# Altium schematic sheet Power.SchDoc
size C; SheetNumber: 1; SheetTotal: 1; SPICEModelCacheRKNZGAWU: <root> / <DocumentId>RKNZGAWU</DocumentId> / </root>
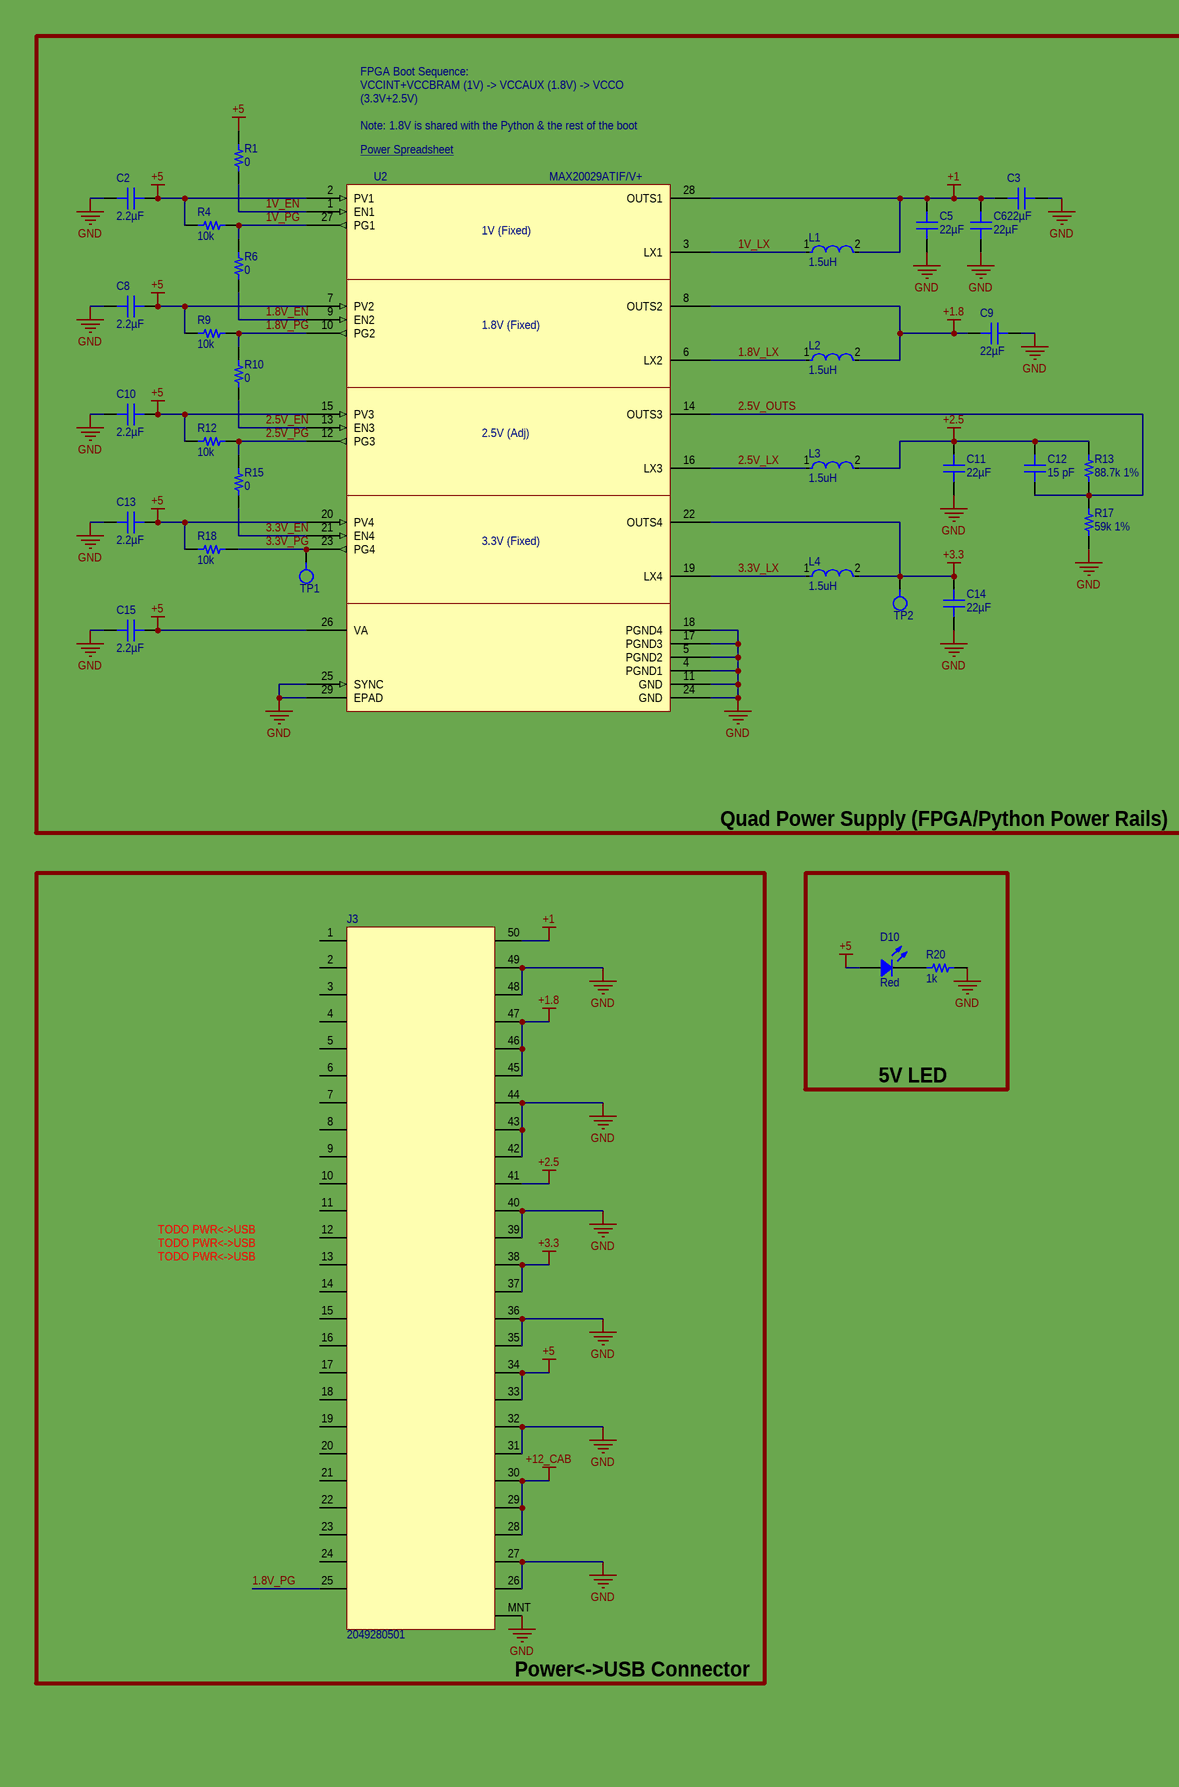
[diagram p0: Power.SchDoc, left]
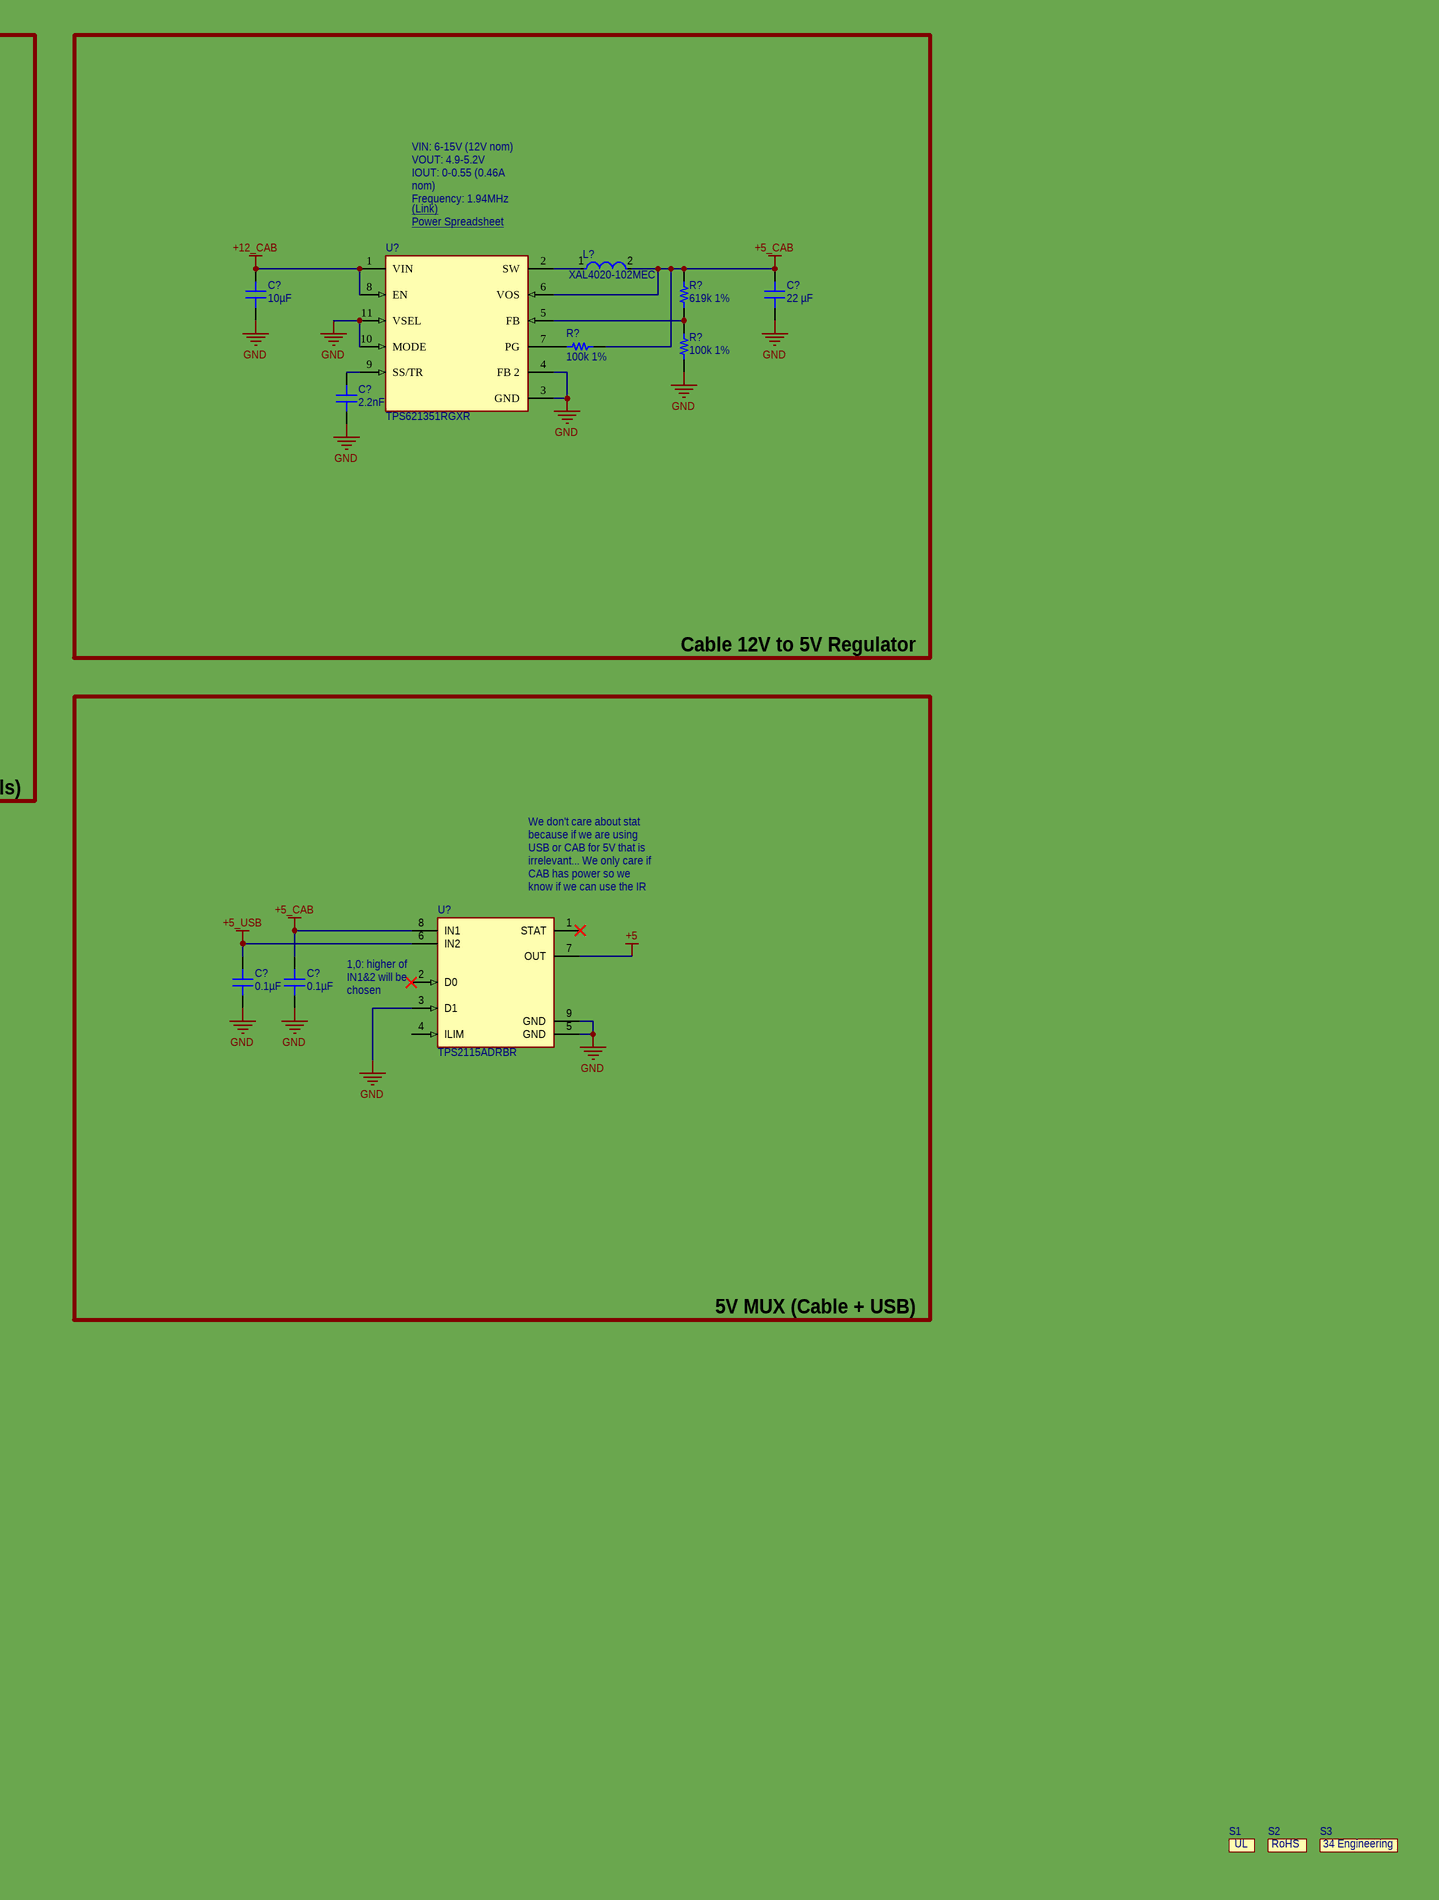
[diagram p1: Power.SchDoc, right]

## Parts
(Parts that share a designator on the sheet are numbered #1, #2 ... from top to bottom, then left to right.)
C2  2.2µF  [CAP 0603_1608]
C3  22µF  [CAP 0603_1608]
C5  22µF  [CAP 0603_1608]
C6  22µF  [CAP 0603_1608]
C8  2.2µF  [CAP 0603_1608]
C9  22µF  [CAP 0603_1608]
C10  2.2µF  [CAP 0603_1608]
C11  22µF  [CAP 0603_1608]
C12  15 pF  [CAP 0402_1005]
C13  2.2µF  [CAP 0603_1608]
C14  22µF  [CAP 0603_1608]
C15  2.2µF  [CAP 0603_1608]
C?#1  10µF  [CAP 0805_2012]
C?#2  22 µF  [CAP 0805_2012]
C?#3  2.2nF  [CAP 0402_1005]
C?#4  0.1µF  [CAP 0402_1005]
C?#5  0.1µF  [CAP 0402_1005]
D10  Red  [LED 0603_1608 RED]
J3  2049280501  [2049280501]
L1  1.5uH  [FP-DFE252012C-IPC_C]
L2  1.5uH  [FP-DFE252012C-IPC_C]
L3  1.5uH  [FP-DFE252012C-IPC_C]
L4  1.5uH  [FP-DFE252012C-IPC_C]
L?  XAL4020-102MEC  [FP-XAL4020-102MEC-MFG]
R1  0  [RES 0402_1005]
R4  10k  [RES 0402_1005]
R6  0  [RES 0402_1005]
R9  10k  [RES 0402_1005]
R10  0  [RES 0402_1005]
R12  10k  [RES 0402_1005]
R13  88.7k 1%  [RES 0402_1005]
R15  0  [RES 0402_1005]
R17  59k 1%  [RES 0402_1005]
R18  10k  [RES 0402_1005]
R20  1k  [RES 0402_1005]
R?#1  619k 1%  [RES 0402_1005]
R?#2  100k 1%  [RES 0402_1005]
R?#3  100k 1%  [RES 0402_1005]
S1  (no value)  [UL]
S2  (no value)  [RoHS]
S3  (no value)  [34EngineeringLogo]
TP1  (no value)  [TestPoint1mm]
TP2  (no value)  [TestPoint1mm]
U2  MAX20029ATIF/V+  [MAX20029ATIF/V+]
U?#1  TPS621351RGXR  [FP-RGX0011A-MFG]
U?#2  TPS2115ADRBR  [FP-DRB0008B-IPC_B]

## Blocks framed on the sheet
Quad Power Supply (FPGA/Python Power Rails): C2 C3 C5 C6 C8-C15 L1-L4 R1 R4 R6 R9 R10 R12 R13 R15 R17 R18 TP1 TP2 U2
Cable 12V to 5V Regulator: C?#1-C?#3 L? R?#1-R?#3 U?#1
5V MUX (Cable + USB): C?#4 C?#5 U?#2
Power<->USB Connector: J3
5V LED: D10 R20

## Nets
+1: C3.2 C5.2 C6.2 J3.50 L1.2 U2.28(OUTS1)
+1.8: C9.2 J3.45 J3.46 J3.47 L2.2 U2.8(OUTS2)
+2.5: C11.2 C12.2 J3.41 L3.2 R13.2
+3.3: C14.2 J3.37 J3.38 L4.2 TP2.1 U2.22(OUTS4)
+5: C2.2 C8.2 C10.2 C13.2 C15.2 D10.1 J3.33 J3.34 R1.2 R4.2 R9.2 R12.2 R18.2 U2.2(PV1) U2.7(PV2) U2.15(PV3) U2.20(PV4) U2.26(VA) U?#2.7(OUT)
+5_CAB: C?#2.2 C?#5.2 L?.2 R?#1.2 R?#2.1 U?#1.6(VOS) U?#2.8(IN1)
+5_USB: C?#4.2 U?#2.6(IN2)
+12_CAB: C?#1.2 J3.28 J3.29 J3.30 U?#1.1(VIN) U?#1.8(EN)
GND: C2.1 C3.1 C5.1 C6.1 C8.1 C9.1 C10.1 C11.1 C13.1 C14.1 C15.1 C?#1.1 C?#2.1 C?#3.1 C?#4.1 C?#5.1 J3.26 J3.27 J3.31 J3.32 J3.35 J3.36 J3.39 J3.40 J3.42 J3.43 J3.44 J3.48 J3.49 J3.MNT R17.1 R20.2 R?#3.1 U2.4(PGND1) U2.5(PGND2) U2.11(GND) U2.17(PGND3) U2.18(PGND4) U2.24(GND) U2.25(SYNC) U2.29(EPAD) U?#1.3(GND) U?#1.4(FB_2) U?#1.10(MODE) U?#1.11(VSEL) U?#2.3(D1) U?#2.5(GND) U?#2.9(GND)
1.8V_EN: R6.1 U2.9(EN2)
1.8V_LX: L2.1 U2.6(LX2)
1.8V_PG: J3.25 R9.1 R10.2 U2.10(PG2)
1V_EN: R1.1 U2.1(EN1)
1V_LX: L1.1 U2.3(LX1)
1V_PG: R4.1 R6.2 U2.27(PG1)
2.5V_EN: R10.1 U2.13(EN3)
2.5V_LX: L3.1 U2.16(LX3)
2.5V_OUTS: C12.1 R13.1 R17.2 U2.14(OUTS3)
2.5V_PG: R12.1 R15.2 U2.12(PG3)
3.3V_EN: R15.1 U2.21(EN4)
3.3V_LX: L4.1 U2.19(LX4)
3.3V_PG: R18.1 TP1.1 U2.23(PG4)
NetC?#3_2: C?#3.2 U?#1.9(SS/TR)
NetD10_2: D10.2 R20.1
NetL?_1: L?.1 U?#1.2(SW)
NetR?#1_1: R?#1.1 R?#3.2 U?#1.5(FB)
NetR?#2_2: R?#2.2 U?#1.7(PG)

Not connected (* = marked no-connect by the designer): J3 1 2 3 4 5 6 7 8 9 10 11 12 13 14 15 16 17 18 19 20 21 22 23 24; U?#2 1(STAT)* 2(D0)* 4(ILIM)

## Notes on the sheet
- FPGA Boot Sequence:
  VCCINT+VCCBRAM (1V) -> VCCAUX (1.8V) -> VCCO (3.3V+2.5V)
  Note: 1.8V is shared with the Python & the rest of the boot sequence is on PCB B
- (near U2) Power Spreadsheet <https://docs.google.com/spreadsheets/d/1ZgsUlgWdU-n38x_ZLdApPnWk-g0t3dJyEVXrgmfgov0/edit#gid=0>
- (near U2) 1V (Fixed)
- (Link) <https://webench.ti.com/power-designer/switching-regulator/customize/42?noparams=0>
- VIN: 6-15V (12V nom)
  VOUT: 4.9-5.2V
  IOUT: 0-0.55 (0.46A nom)
  Frequency: 1.94MHz
  Efficiency: 90.3% nom
- (near U?#1) Power Spreadsheet <https://docs.google.com/spreadsheets/d/1ZgsUlgWdU-n38x_ZLdApPnWk-g0t3dJyEVXrgmfgov0/edit#gid=0>
- (near U2) 1.8V (Fixed)
- (near U2) 2.5V (Adj)
- (near U2) 3.3V (Fixed)
- (near U?#2) We don't care about stat because if we are using USB or CAB for 5V that is irrelevant... We only care if CAB has power so we know if we can use the IR LEDs
- (near U?#2) 1,0: higher of IN1&2 will be chosen
- TODO PWR<->USB
- (in symbol 34EngineeringLogo) 34 Engineering

## Library data of the parts
C2 C8 C10 C13 C15 = 0603ZD225MAT2A: CAP CER 2.2UF 10V X5R 0603; manufacturer: AVX Corporation; Tolerance: ±20%; Part Number: 0603ZD225MAT2A; Value: 2.2µF; Applications: General Purpose; Capacitance: 2.2µF; componentlink1description: Datasheet; componentlink1url: http://datasheets.avx.com/cx5r.pdf; componentlink2description: DigiKey Link; componentlink2url: http://digikey.com/product-detail/en/avx-corporation/0603ZD225MAT2A/478-7941-1-ND/3881564; Device Package: 0603 (1608 Metric); lastupdated: 9/2/2020 1:03:07 AM; Lifecycle Status: Active; Minimum Order: 1; Mounting Type: Surface Mount, MLCC; Operating Temperature: -55°C ~ 85°C; Package / Case: 0603 (1608 Metric); packaging: TapeAndReel; partid: 16270; Part Status: Active; price: 0.04; series: -; Size / Dimension: 0.063" L x 0.032" W (1.60mm x 0.81mm); Supplier 1: DigiKey; Supplier Part Number 1: 478-7941-1-ND; Temperature Coefficient: X5R; Thickness (Max): 0.035" (0.90mm); Voltage - Rated: 10V
C3 C5 C6 C9 C11 C14 = 06036D226MAT2A: CAP CER 22UF 6.3V X5R 0603; manufacturer: AVX Corporation; Tolerance: ±20%; Part Number: 06036D226MAT2A; Value: 22µF; Applications: General Purpose; Capacitance: 22µF; componentlink1description: Datasheet; componentlink1url: http://datasheets.avx.com/cx5r.pdf; componentlink2description: DigiKey Link; componentlink2url: http://digikey.com/product-detail/en/avx-corporation/06036D226MAT2A/478-10812-1-ND/7536349; Device Package: 0603 (1608 Metric); lastupdated: 9/2/2020 1:03:16 AM; Lifecycle Status: Active; Minimum Order: 1; Mounting Type: Surface Mount, MLCC; Operating Temperature: -55°C ~ 85°C; Package / Case: 0603 (1608 Metric); packaging: TapeAndReel; partid: 13180; Part Status: Active; price: 0.10; series: -; Size / Dimension: 0.063" L x 0.032" W (1.60mm x 0.81mm); Supplier 1: DigiKey; Supplier Part Number 1: 478-10812-1-ND; Temperature Coefficient: X5R; Thickness (Max): 0.040" (1.02mm); Voltage - Rated: 6.3V
C12 = 885012005008: CAP CER 15PF 10V C0G/NP0 0402; manufacturer: Würth Elektronik; Temperature Coefficient: C0G, NP0; Tolerance: ±5%; Part Number: 885012005008; Value: 15 pF; Applications: General Purpose; Capacitance: 15 pF; componentlink1description: Datasheet; componentlink1url: https://katalog.we-online.de/pbs/datasheet/885012005008.pdf; componentlink2description: DigiKey Link; componentlink2url: https://www.digikey.com/en/products/detail/würth-elektronik/885012005008/5453281; Device Package: 0402 (1005 Metric); lastupdated: 7/10/2022 8:59:25 AM; Lifecycle Status: Active; Minimum Order: 1; Mounting Type: Surface Mount, MLCC; Operating Temperature: -55°C ~ 125°C; Package / Case: 0402 (1005 Metric); packaging: TapeAndReel; partid: 7101; Part Status: Active; price: 0.01; series: WCAP-CSGP; Size / Dimension: 0.039" L x 0.020" W (1.00mm x 0.50mm); Supplier 1: DigiKey; Supplier Part Number 1: 732-7426-1-ND; Thickness (Max): 0.022" (0.55mm); Voltage - Rated: 10V
C?#1 = 08053D106KAT2A: CAP CER 10UF 25V X5R 0805; manufacturer: AVX Corporation; Tolerance: ±10%; Part Number: 08053D106KAT2A; Value: 10µF; Applications: General Purpose; Capacitance: 10µF; componentlink1description: Datasheet; componentlink1url: http://datasheets.avx.com/cx5r.pdf; componentlink2description: DigiKey Link; componentlink2url: http://digikey.com/product-detail/en/avx-corporation/08053D106KAT2A/478-7436-1-ND/3660337; Device Package: 0805 (2012 Metric); lastupdated: 9/2/2020 1:04:14 AM; Lifecycle Status: Active; Minimum Order: 1; Mounting Type: Surface Mount, MLCC; Operating Temperature: -55°C ~ 85°C; Package / Case: 0805 (2012 Metric); packaging: TapeAndReel; partid: 15850; Part Status: Active; price: 0.13; series: -; Size / Dimension: 0.079" L x 0.049" W (2.00mm x 1.25mm); Supplier 1: DigiKey; Supplier Part Number 1: 478-7436-1-ND; Temperature Coefficient: X5R; Thickness (Max): 0.051" (1.30mm); Voltage - Rated: 25V
C?#2 = TMK212BBJ226MG-TT: CAP CER 22UF 25V X5R 0805; manufacturer: Taiyo Yuden; Tolerance: ±20%; Part Number: TMK212BBJ226MG-TT; Value: 22 µF; Applications: SMPS Filtering; Capacitance: 22 µF; componentlink1description: Datasheet; componentlink1url: https://ds.yuden.co.jp/TYCOMPAS/ut/detail?pn=TMK212BBJ226MG-TT &u=M; componentlink2description: DigiKey Link; componentlink2url: https://www.digikey.com/en/products/detail/taiyo-yuden/TMK212BBJ226MG-TT/7403956; Device Package: 0805 (2012 Metric); lastupdated: 7/10/2022 9:05:54 AM; Lifecycle Status: Active; Minimum Order: 1; Mounting Type: Surface Mount, MLCC; Operating Temperature: -55°C ~ 85°C; Package / Case: 0805 (2012 Metric); packaging: TapeAndReel; partid: 8285; Part Status: Active; price: 0.21; series: M; Size / Dimension: 0.079" L x 0.049" W (2.00mm x 1.25mm); Supplier 1: DigiKey; Supplier Part Number 1: 587-6359-1-ND; Temperature Coefficient: X5R; Thickness (Max): 0.057" (1.45mm); Voltage - Rated: 25V
C?#3 = C0402C222K3RAC7867: CAP CER 2200PF 25V X7R 0402; manufacturer: KEMET; Tolerance: ±10%; Part Number: C0402C222K3RAC7867; Applications: Bypass, Decoupling; Capacitance: 2200 pF; componentlink1description: Datasheet; componentlink1url: https://api.kemet.com/component-edge/download/datasheet/C0402C222K3RACTU.pdf; componentlink2description: DigiKey Link; componentlink2url: https://www.digikey.com/en/products/detail/kemet/C0402C222K3RAC7867/411035; Device Package: 0402 (1005 Metric); lastupdated: 8/14/2022 9:05:11 PM; Lifecycle Status: Active; Minimum Order: 1; Mounting Type: Surface Mount, MLCC; Operating Temperature: -55°C ~ 125°C; Package / Case: 0402 (1005 Metric); packaging: TapeAndReel; partid: 33073; Part Status: Active; price: 0.01; series: SMD Comm X7R; Size / Dimension: 0.039" L x 0.020" W (1.00mm x 0.50mm); Supplier 1: DigiKey; Supplier Part Number 1: 399-C0402C222K3RAC7867CT-ND; Temperature Coefficient: X7R; Thickness (Max): 0.022" (0.55mm); Voltage - Rated: 25V
C?#4 C?#5 = CGA2B3X5R1E104K050BB: CAP CER 0.1UF 25V X5R 0402; manufacturer: TDK Corporation; Tolerance: ±10%; Part Number: CGA2B3X5R1E104K050BB; Applications: Automotive; Capacitance: 0.1 µF; componentlink1description: Datasheet; componentlink1url: https://product.tdk.com/info/en/catalog/datasheets/mlcc_automotive_general_en.pdf?ref_disty=digikey; componentlink2description: DigiKey Link; componentlink2url: https://www.digikey.com/en/products/detail/tdk-corporation/CGA2B3X5R1E104K050BB/3949421; Device Package: 0402 (1005 Metric); lastupdated: 8/14/2022 9:05:24 PM; Lifecycle Status: Active; Minimum Order: 1; Mounting Type: Surface Mount, MLCC; Operating Temperature: -55°C ~ 85°C; Package / Case: 0402 (1005 Metric); packaging: TapeAndReel; partid: 45466; Part Status: Active; price: 0.01; Ratings: AEC-Q200; series: CGA; Size / Dimension: 0.039" L x 0.020" W (1.00mm x 0.50mm); Supplier 1: DigiKey; Supplier Part Number 1: 445-12185-1-ND; Temperature Coefficient: X5R; Thickness (Max): 0.022" (0.55mm); Voltage - Rated: 25V
D10 = SML-D12U1WT86: LED RED DIFFUSED 1608 SMD; Manufacturer: Rohm Semiconductor; Configuration: Standard; Current - Test: 20mA; Lens Color: White; Lens Size: 1.20mm x 0.80mm; Lens Style: Rectangle with Flat Top; Millicandela Rating: 63mcd; Voltage - Forward (Vf) (Typ): 2.2V; Wavelength - Dominant: 620nm; Part Number: SML-D12U1WT86; Color: Red; ComponentLink1Description: Datasheet; ComponentLink1URL: https://www.rohm.com/datasheet/SML-D12U1W; ComponentLink2Description: DigiKey Link; ComponentLink2URL: https://www.digikey.com/en/products/detail/rohm-semiconductor/SML-D12U1WT86/5843853; Device Package: 0603 (1608 Metric); Height (Max): 0.65mm; LastUpdated: 7/10/2022 9:48:39 AM; Lens Transparency: Diffused; Lifecycle Status: Active; Minimum Order: 1; Mounting Type: Surface Mount; Package / Case: 0603 (1608 Metric); Packaging: TapeAndReel; PartId: 452; Part Status: Active; Price: 0.02; Series: SML-D12; Size / Dimension: 1.60mm L x 0.80mm W; Supplier 1: DigiKey; Supplier Part Number 1: SML-D12U1WT86CT-ND; Supplier Device Package: 1608 (0603); Value: Red
J3 = 2049280501: SlimStack Board-to-Board Plug, 0.40mm Pitch, FSB3 Floating Series, 3.00mm Mated Height, 3.20 Mated Width, 50 Circuits; Manufacturer: Molex; Manufacturer Part Number: 203955-0503; RoHS: No; Stock 1: 8554; Pricing 1: 1=4.46000, 10=3.93000, 50=3.93000, 100=3.13000, 500=3.04000, 1000=2.59000, 3000=2.41000, 6000=2.32000, 9000=2.23000, 10000=2.41000 (USD); Supplier 1: Mouser; Supplier Part Number 1: 538-204928-0501
L1-L4 = CMP-06042-006881-1: Shielded Wirewound Inductor 1.5uH 20% 2600mA 0.06Ω 1008 (2520); Max DC Current: 2.6A; Current Rating: 3.5A; DC Resistance (DCR): 60mR; Core Material: Ferrite; Test Frequency: 1MHz; Height - Seated (Max): 0.039inch; Case Code (Metric): 2520; Max Operating Temperature: 125°C; Mount: Surface Mount; Shielding: Shielded; Length: 0.098inch; Depth: 2mm; Inductance: 1.5uH; Min Operating Temperature: -40°C; Tolerance: 20%; Case/Package: 1008; Case Code (Imperial): 1008; Width: 0.079inch; Resistor Type: Wirewound; Packaging: Tape and Reel
L? = CMP-11268-000037-1: Fixed Inductors 1uH 20% 9.6A 14.60mOhms AEC-Q200; Manufacturer: Coilcraft; Saturation Current: 8.7A; Core Material: Composite; Test Frequency: 1MHz; Standoff Height: 0.1mm; Shielding: true; Automotive Grade: Grade 1; Self Resonant Frequency: 79MHz; Series Resistance: 14.6mΩ; Rms Current: 9.6A; Category: Ind; RoHS: TRUE; Device Class L2: Inductors; Mouser Description: Power inductor, shielded, 20% tol, SMT, RoHS, halogen f; Lead Free: Yes; Device Class L1: Passive Components; Inductance: 1uH; ComponentLink2URL: https://www.coilcraft.com/pdfs/xal4000.pdf; Height: 2.1mm; Device Class L3: Fixed Inductors; Composition: Wirewound; Package: 0; Ambient Temperature Range Low: -40°C; Automotive: Yes; Ambient Temperature Range High: +125°C; ComponentLink2Description: Datasheet; Octopart: https://octopart.com/xal4020-102mec-coilcraft-13142161; Tolerance: 20%; Value: 1uH; Manufacturer Part Number: XAL4020-102MEC
R1 R6 R10 R15 = SFR01MZPJ000: RES 0 OHM JUMPER 1/16W 0402; Manufacturer: Rohm Semiconductor; Value: 0 Ohms; Power (Watts): 0.063W, 1/16W; Part Number: SFR01MZPJ000; ComponentLink1Description: Datasheet; ComponentLink1URL: https://www.rohm.com/datasheet/SFR01MZPJ/sfr-e; ComponentLink2Description: DigiKey Link; ComponentLink2URL: https://www.digikey.com/en/products/detail/rohm-semiconductor/SFR01MZPJ000/9771849; Composition: Thick Film; Device Package: 0402 (1005 Metric); Features: Anti-Sulfur; Height - Seated (Max): 0.016" (0.40mm); LastUpdated: 7/10/2022 9:15:04 AM; Lifecycle Status: Active; Minimum Order: 1; Number of Terminations: 2; Operating Temperature: -55°C ~ 155°C; Package / Case: 0402 (1005 Metric); Packaging: TapeAndReel; PartId: 3203; Part Status: Active; Price: 0.01; Resistance: 0 Ohms; Series: SFR; Size / Dimension: 0.039" L x 0.020" W (1.00mm x 0.50mm); Supplier 1: DigiKey; Supplier Part Number 1: 511-1816-1-ND; Supplier Device Package: 0402; Tolerance: Jumper
R4 R9 R12 R18 = MCS0402MC1002FE000: RES SMD 10K OHM 1% 1/10W 0402; Manufacturer: Vishay Beyschlag; Value: 10 kOhms; Power (Watts): 0.1W, 1/10W; Temperature Coefficient: ±50ppm/°C; Part Number: MCS0402MC1002FE000; ComponentLink1Description: Datasheet; ComponentLink1URL: http://www.vishay.com/docs/28760/mcat_pro.pdf; ComponentLink2Description: DigiKey Link; ComponentLink2URL: http://digikey.com/product-detail/en/vishay-beyschlag/MCS0402MC1002FE000/MCS0402-10.0K-MFCT-ND/3883092; Composition: Thin Film; Device Package: 0402 (1005 Metric); Features: Anti-Sulfur, Automotive AEC-Q200; Height - Seated (Max): 0.015" (0.37mm); LastUpdated: 7/10/2022 9:15:04 AM; Lifecycle Status: Active; Minimum Order: 1; Number of Terminations: 2; Operating Temperature: -55°C ~ 175°C; Package / Case: 0402 (1005 Metric); Packaging: TapeAndReel; PartId: 3152; Part Status: Active; Price: 0.03; Ratings: AEC-Q200; Resistance: 10 kOhms; Series: MCS AT - Professional; Size / Dimension: 0.039" L x 0.020" W (1.00mm x 0.50mm); Supplier 1: DigiKey; Supplier Part Number 1: MCS0402-10.0K-MFCT-ND; Supplier Device Package: 0402; Tolerance: ±1%
R13 = RC0402FR-0788K7L: RES 88.7K OHM 1% 1/16W 0402; Manufacturer: Yageo; Value: 88.7 kOhms; Power (Watts): 0.063W, 1/16W; Temperature Coefficient: ±100ppm/°C; Part Number: RC0402FR-0788K7L; ComponentLink1Description: Datasheet; ComponentLink1URL: https://www.yageo.com/upload/media/product/productsearch/datasheet/rchip/PYu-RC_Group_51_RoHS_L_10.pdf; ComponentLink2Description: DigiKey Link; ComponentLink2URL: https://www.digikey.com/en/products/detail/yageo/RC0402FR-0788K7L/726667; Composition: Thick Film; Device Package: 0402 (1005 Metric); Features: Moisture Resistant; Height - Seated (Max): 0.016" (0.40mm); LastUpdated: 7/10/2022 9:15:05 AM; Lifecycle Status: Active; Minimum Order: 1; Number of Terminations: 2; Operating Temperature: -55°C ~ 155°C; Package / Case: 0402 (1005 Metric); Packaging: CutTape; PartId: 2803; Part Status: Active; Price: 0.01; Resistance: 88.7 kOhms; Series: RC_L; Size / Dimension: 0.039" L x 0.020" W (1.00mm x 0.50mm); Supplier 1: DigiKey; Supplier Part Number 1: 311-88.7KLRCT-ND; Supplier Device Package: 0402; Tolerance: ±1%
R17 = RC0402FR-0759KL: RES 59K OHM 1% 1/16W 0402; Manufacturer: Yageo; Value: 59 kOhms; Power (Watts): 0.063W, 1/16W; Temperature Coefficient: ±100ppm/°C; Part Number: RC0402FR-0759KL; ComponentLink1Description: Datasheet; ComponentLink1URL: https://www.yageo.com/upload/media/product/productsearch/datasheet/rchip/PYu-RC_Group_51_RoHS_L_10.pdf; ComponentLink2Description: DigiKey Link; ComponentLink2URL: https://www.digikey.com/en/products/detail/yageo/RC0402FR-0759KL/2827634; Composition: Thick Film; Device Package: 0402 (1005 Metric); Features: Moisture Resistant; Height - Seated (Max): 0.016" (0.40mm); LastUpdated: 7/10/2022 9:15:06 AM; Lifecycle Status: Active; Minimum Order: 1; Number of Terminations: 2; Operating Temperature: -55°C ~ 155°C; Package / Case: 0402 (1005 Metric); Packaging: CutTape; PartId: 2653; Part Status: Active; Price: 0.01; Resistance: 59 kOhms; Series: RC_L; Size / Dimension: 0.039" L x 0.020" W (1.00mm x 0.50mm); Supplier 1: DigiKey; Supplier Part Number 1: 311-59KLRCT-ND; Supplier Device Package: 0402; Tolerance: ±1%
R20 = RK73H1ETTP1001F: RES 1K OHM 1% 1/10W 0402; Manufacturer: KOA Speer Electronics, Inc.; Power (Watts): 0.1W, 1/10W; Resistance: 1 kOhms; Temperature Coefficient: ±100ppm/°C; Part Number: RK73H1ETTP1001F; ComponentLink1Description: Datasheet; ComponentLink1URL: http://www.koaspeer.com/catimages/Products/RK73H/RK73H.pdf; ComponentLink2Description: DigiKey Link; ComponentLink2URL: https://www.digikey.com/en/products/detail/koa-speer-electronics-inc/RK73H1ETTP1001F/9844155; Composition: Thick Film; Device Package: 0402 (1005 Metric); Features: Automotive AEC-Q200, Moisture Resistant; Height - Seated (Max): 0.016" (0.40mm); LastUpdated: 7/15/2022 11:42:29 AM; Lifecycle Status: Active; Minimum Order: 1; Number of Terminations: 2; Operating Temperature: -55°C ~ 155°C; Package / Case: 0402 (1005 Metric); Packaging: CutTape; PartId: 16007; Part Status: Active; Price: 0.01; Ratings: AEC-Q200; Series: RK73H; Size / Dimension: 0.039" L x 0.020" W (1.00mm x 0.50mm); Supplier 1: DigiKey; Supplier Part Number 1: 2019-RK73H1ETTP1001FCT-ND; Supplier Device Package: 0402; Tolerance: ±1%
R?#1 = RC0402FR-07619KL: RES 619K OHM 1% 1/16W 0402; Manufacturer: Yageo; Power (Watts): 0.063W, 1/16W; Resistance: 619 kOhms; Temperature Coefficient: ±100ppm/°C; Part Number: RC0402FR-07619KL; ComponentLink1Description: Datasheet; ComponentLink1URL: https://www.yageo.com/upload/media/product/productsearch/datasheet/rchip/PYu-RC_Group_51_RoHS_L_10.pdf; ComponentLink2Description: DigiKey Link; ComponentLink2URL: https://www.digikey.com/en/products/detail/yageo/RC0402FR-07619KL/5281060; Composition: Thick Film; Device Package: 0402 (1005 Metric); Features: Moisture Resistant; Height - Seated (Max): 0.016" (0.40mm); LastUpdated: 8/14/2022 9:23:19 PM; Lifecycle Status: Active; Minimum Order: 1; Number of Terminations: 2; Operating Temperature: -55°C ~ 155°C; Package / Case: 0402 (1005 Metric); Packaging: CutTape; PartId: 19141; Part Status: Active; Price: 0.01; Series: RC_L; Size / Dimension: 0.039" L x 0.020" W (1.00mm x 0.50mm); Supplier 1: DigiKey; Supplier Part Number 1: YAG3200CT-ND; Supplier Device Package: 0402; Tolerance: ±1%
R?#2 R?#3 = MCS04020C1003FE000: RES SMD 100K OHM 1% 1/10W 0402; Manufacturer: Vishay Beyschlag; Value: 100 kOhms; Power (Watts): 0.1W, 1/10W; Temperature Coefficient: ±50ppm/°C; Part Number: MCS04020C1003FE000; ComponentLink1Description: Datasheet; ComponentLink1URL: http://www.vishay.com/docs/28705/mcx0x0xpro.pdf; ComponentLink2Description: DigiKey Link; ComponentLink2URL: http://digikey.com/product-detail/en/vishay-beyschlag/MCS04020C1003FE000/MCS0402-100K-CFCT-ND/2607930; Composition: Thin Film; Device Package: 0402 (1005 Metric); Features: Anti-Sulfur; Height - Seated (Max): 0.015" (0.37mm); LastUpdated: 7/10/2022 9:15:04 AM; Lifecycle Status: Active; Minimum Order: 1; Number of Terminations: 2; Operating Temperature: -55°C ~ 155°C; Package / Case: 0402 (1005 Metric); Packaging: TapeAndReel; PartId: 3149; Part Status: Active; Price: 0.03; Resistance: 100 kOhms; Series: MCS - Professional; Size / Dimension: 0.039" L x 0.020" W (1.00mm x 0.50mm); Supplier 1: DigiKey; Supplier Part Number 1: MCS0402-100K-CFCT-ND; Supplier Device Package: 0402; Tolerance: ±1%
S1 = UL
S2 = RoHS
S3 = 34EngineeringLogo: 34 Engineering Silkscreen Logo
TP1 TP2 = TestPoint1mm: Test Point 1mm Diameter
U2 = MAX20029ATIF/V+: DC to DC Converter Quad Step-Down 3V to 5.5V Automotive 28-Pin TQFN Tube; Mfr_Name: Maxim Integrated Products; Manufacturer: Maxim; Copyright: Copyright (C) 2022 Ultra Librarian. All rights reserved.; Manufacturer_Part_Number: MAX20029ATIF/V+; RefDes: RefDes; Type: DEV; Supplier 1: Mouser; Manufacturer Part Number: MAX20029ATIF/V+; RoHS: Yes; Stock 1: 121; Pricing 1: 1=3.71000, 10=3.34000, 25=3.15000, 50=3.15000, 100=3.15000, 120=2.72000, 300=2.64000, 540=2.41000, 1000=2.41000, 1020=2.29000, 2520=2.25000, 10000=2.25000 (USD); Supplier Part Number 1: 700-MAX20029ATIF/V+
U?#1 = CMP-04918-000673-1: IC REG BUCK ADJ 3.5A 11VQFN; Output Configuration: Positive; Min Output Voltage: 800mV; Max Output Voltage: 12V; Quiescent Current: 18uA; Min Input Voltage: 3V; Output Type: Adjustable; Switching Frequency: 2.5MHz; Synchronous Rectifier: Yes; Max Input Voltage: 17V; Number of Outputs: 1; Output Current: 3.5A; Packaging: Tape and Reel; Mount: Surface Mount; Min Operating Temperature: -40°C; RoHS Compliant: Yes; Max Operating Temperature: 125°C; Number of Pins: 11; Lead Free: Lead Free; Case/Package: VQFN
U?#2 = CMP-0339-00011-3: IC OR CTRLR SRC SELECT 8SON; Output Current: 1.25A; Operating Supply Current: 55uA; Number of Inputs: 2; Max Input Voltage: 5.5V; Turn-On Delay Time: 1ms; Max Power Dissipation: 2.5W; Turn-Off Delay Time: 5ms; Min Input Voltage: 2.8V; On-State Resistance: 150mR; Number of Outputs: 1; Package Quantity: 3000; Current - Output 2: 1.25A; REACH SVHC: No SVHC; Case/Package: TSSOP; Weight: 0.000847oz; Max Output Current: 1.25A; Radiation Hardening: No; Number of Pins: 8; Max Operating Temperature: 85°C; Lead Free: Lead Free; Packaging: Tape and Reel; Operating Supply Voltage: 5.5V; Max Supply Current: 55uA; Min Operating Temperature: -40°C